# EAGLE design Super-Regenerative-Airband-1Transistor-Kamarudin2008-old (EAGLE 7.2.0)
VHF Superregen for AM Aircraft Band by Kamarudin 2008 - arjip.wordpress.com https://arjip.wordpress.com/tag/airband-scanner/ https://arjip.wordpress.com/tag/super-regenerative/ http://radiobuilder.blogspot.ch/2012/10/airbandregen1t.html
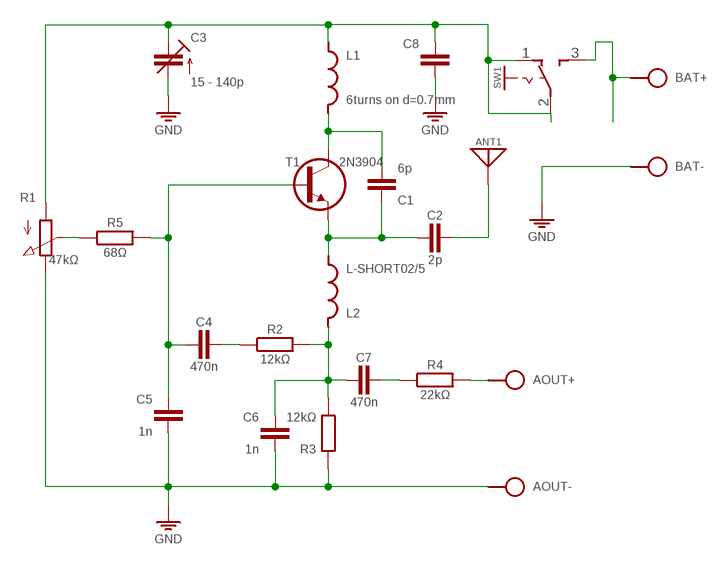
[diagram p0: schematic, sheet 1]

## Parts
ANT1  ANT  [SPAD]
AOUT+  SPAD  [SPAD]
AOUT-  SPAD  [SPAD]
BAT+  SPAD  [SPAD]
BAT-  SPAD  [SPAD]
C1  6p  C050-020X036  [C050-020X036]
C2  2p  C025-015X024  [C025-015X024]
C3  15 - 140p  C-TR-PH201272222-808-2PINB  [TRIM-2222-808]
C4  470n  C050-020X036  [C050-020X036]
C5  1n  C025-020X036  [C025-020X036]
C6  1n  C050-020X036  [C050-020X036]
C7  470n  C050-020X036  [C050-020X036]
C8  C050-025X075  [C050-025X075]
L1  6turns on d=0.7mm  L-SHORT04-5/5V  [L-04-5/6V]
L2  L-SHORT02/5  [L-02/5V]
R1  47kΩ  POT  [POT]
R2  12kΩ  R-H0202/7  [0202/7]
R3  12kΩ  R0202/7  [0202/7]
R4  22kΩ  R-H0202/7  [0202/7]
R5  68Ω  R-H0202/7  [0202/7]
SW1  SL-SW-1P-2T-H  [SLSW-1P2T-H]
T1  2N3904  [TO92]

## Nets
GND: AOUT-.1 BAT-.1 C3.2(A) C5.2 C6.2 C8.2 R1.3(E) R3.2
N$1: C1.2 L1.2 T1.3(C)
N$2: C1.1 C2.2 L2.1 T1.1(E)
N$3: C3.3(E) C8.1 L1.1 R1.1(A) SW1.1(O) SW1.2(P)
N$4: C4.2 C5.1 R5.2 T1.2(B)
N$5: ANT1.1 C2.1
N$7: C4.1 R2.1
N$8: C7.1 R4.1
N$9: BAT+.1 SW1.3(S)
N$10: AOUT+.1 R4.2
N$11: R1.2(S) R5.1
N$12: C6.1 C7.2 L2.2 R2.2 R3.1

## Library data of the parts
ANT1 = pad:ANT
AOUT+ AOUT- BAT+ BAT- = pad:SPAD
C1 C2 C4-C8 = c:C: CAPACITOR, European symbol
C3 = cap-trim:C-TR-PH20127
L1 L2 = l:L-SHORT
R1 = r:POT
R2 R4 R5 = r:R-H
R3 = r:R: RESISTOR, European symbol
SW1 = sw:SL-SW-1P-2T
T1 = t:2N3904

## Net classes
0 default: width 0.61 mm

## Board
VHF Superregen for AM Aircraft Band by Kamarudin 2008 - arjip.wordpress.com https://arjip.wordpress.com/tag/airband-scanner/ https://arjip.wordpress.com/tag/super-regenerative/ http://radiobuilder.blogspot.ch/2012/10/airbandregen1t.html
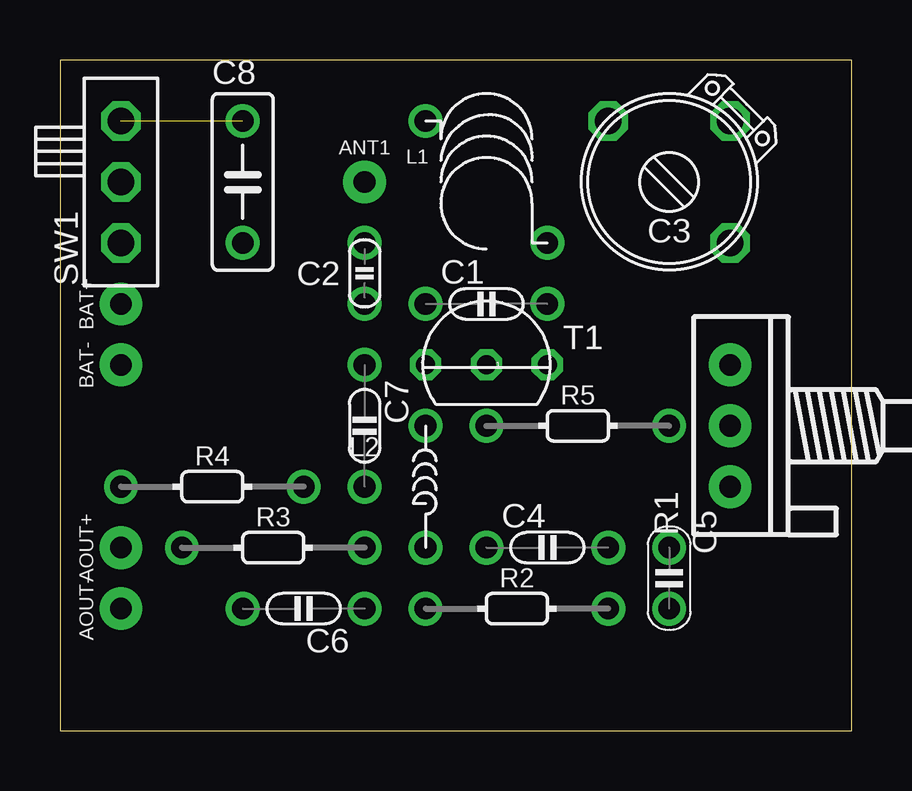
[diagram p1: board, top side]
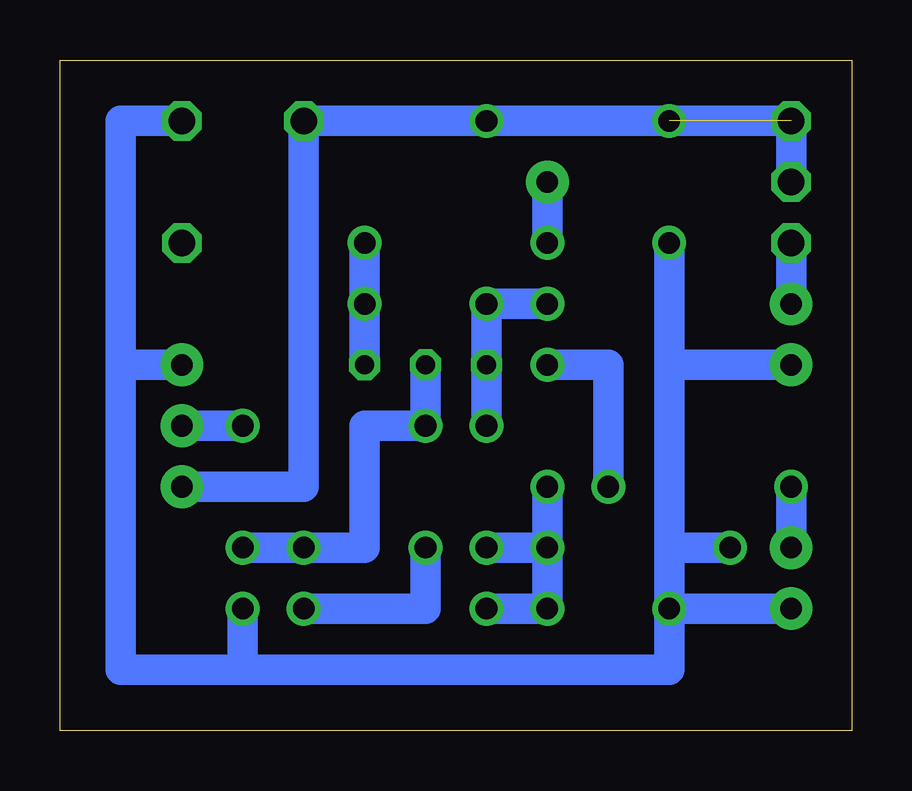
[diagram p2: board, bottom side, seen from below]

Size 33.02 x 27.94 mm. Coordinates in mm from the lower left corner, seen from the top.
Outline: 0,0 33.02,0 33.02,27.94 0,27.94 0,0
Copper layers (1*16): Top 0.035mm / dielectric 1.5mm / Bottom 0.035mm
Design rules "default": minimum track width 10mil, minimum drill 24mil, track to track 8mil, track to pad 8mil, pad to pad 8mil, via to via 8mil, smd to smd 8mil, copper to edge 40mil, drill to drill 8mil, minimum pad ring 10mil, minimum via ring 8mil, stop-mask expansion 4mil, vias tented up to drill 0mil, thermal gap 10mil

### Footprints (pad centres in the part's own frame; a part is rotated, then mirrored left to right if it is on the bottom)
SPAD = drill 0.9 pad 1.778: 1 0,0
C050-020X036 = drill 0.9: 1 -2.54,0; 2 2.54,0
C025-015X024 = drill 0.9: 1 0,1.27; 2 0,-1.27
TRIM-2222-808 = drill 1.1 octagon: 1 -2.54,2.54; 2 -2.54,-2.54; 3 2.54,-2.54
C025-020X036 = drill 0.9: 1 0,0; 2 2.54,0
C050-025X075 = drill 0.9: 1 2.54,0; 2 -2.54,0
L-04-5/6V = drill 0.9: 1 -2.54,2.54; 2 2.54,-2.54
L-02/5V = drill 0.9: 1 0,2.54; 2 0,-2.54
POT = drill 0.9 pad 1.778: 1 -2.54,0; 2 0,0; 3 2.54,0
0202/7 = drill 0.9: 1 0,3.81; 2 0,-3.81
SLSW-1P2T-H = drill 1.1 pad 1.524 octagon: 1 2.54,0; 2 0,0; 3 -2.54,0
TO92 = drill 0.8 octagon: 1 -2.54,0; 2 0,0; 3 2.54,0

### Placement (x,y rotation side)
ANT1  12.7,22.86 270 top
AOUT+  2.54,7.62 0 top
AOUT-  2.54,5.08 0 top
BAT+  2.54,17.78 0 top
BAT-  2.54,15.24 0 top
C1  17.78,17.78 0 top
C2  12.7,19.05 0 top
C3  25.4,22.86 180 top
C4  20.32,7.62 0 top
C5  25.4,7.62 270 top
C6  10.16,5.08 180 top
C7  12.7,12.7 270 top
C8  7.62,22.86 90 top
L1  17.78,22.86 0 top
L2  15.24,10.16 0 top
R1  27.94,12.7 90 top
R2  19.05,5.08 270 top
R3  8.89,7.62 270 top
R4  6.35,10.16 270 top
R5  21.59,12.7 270 top
SW1  2.54,22.86 90 top
T1  17.78,15.24 0 top

### Tracks (layer width: path | path; a pad name or v marks a point on that pad's centre or on a via)
GND
  Bottom 1.27: 30.48,15.24 30.48,25.4 C3.2 | 25.4,2.54 30.48,2.54 30.48,15.24 | 30.48,15.24 R1.3 | C5.2 25.4,2.54 | 25.4,2.54 7.62,2.54 C6.2 | C6.2 AOUT-.1 | 7.62,15.24 7.62,7.62 | BAT-.1 7.62,15.24 | 7.62,15.24 C8.2 | C6.2 7.62,7.62 | 7.62,7.62 R3.2
N$1
  Bottom 1.27: T1.3 C1.2 L1.2
N$2
  Bottom 1.27: C2.2 C1.1 T1.1 L2.1
N$3  (1 unrouted)
  Bottom 1.27: R1.1 22.86,10.16 C3.3 L1.1 SW1.1 SW1.2
N$4
  Bottom 1.27: C5.1 C4.2 20.32,7.62 20.32,12.7 R5.2 T1.2
N$5
  Bottom 1.27: ANT1.1 C2.1
N$7
  Bottom 1.27: R2.1 17.78,5.08 C4.1
N$8
  Bottom 1.27: R4.1 10.16,15.24 C7.1
N$9
  Bottom 1.27: SW1.3 BAT+.1
N$10
  Bottom 1.27: R4.2 AOUT+.1
N$11
  Bottom 1.27: R5.1 R1.2
N$12
  Bottom 1.27: R3.1 C6.1 R2.2 | C7.2 R3.1 | R3.1 L2.2